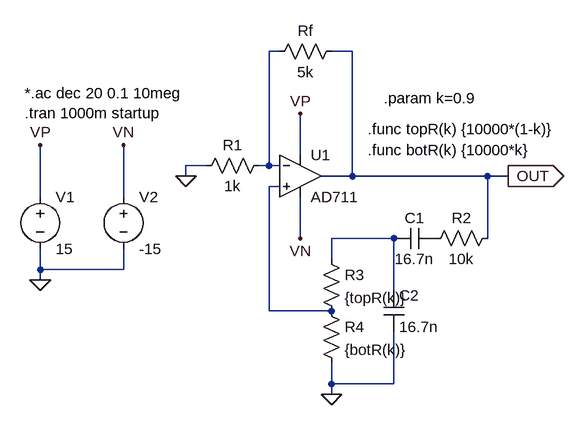
[diagram p0: schematic A2 21.asc]
A2 21.asc, the LTspice schematic file:
Version 4
SHEET 1 880 680
WIRE 128 -16 112 -16
WIRE 240 -16 208 -16
WIRE 160 144 160 80
WIRE 16 160 -16 160
WIRE 112 160 112 -16
WIRE 112 160 96 160
WIRE 128 160 112 160
WIRE -16 176 -16 160
WIRE 240 176 240 -16
WIRE 240 176 192 176
WIRE 448 176 240 176
WIRE 480 176 448 176
WIRE 128 192 112 192
WIRE -240 208 -240 128
WIRE -112 208 -112 128
WIRE 160 272 160 208
WIRE 304 272 208 272
WIRE 448 272 448 176
WIRE 208 304 208 272
WIRE -240 320 -240 288
WIRE -112 320 -112 288
WIRE -112 320 -240 320
WIRE -240 336 -240 320
WIRE 304 352 304 272
WIRE 112 384 112 192
WIRE 208 384 112 384
WIRE 208 496 208 464
WIRE 304 496 304 416
WIRE 304 496 208 496
WIRE 208 512 208 496
FLAG 160 80 VP
FLAG 160 272 VN
FLAG -240 336 0
FLAG -240 128 VP
FLAG -112 128 VN
FLAG 480 176 OUT
IOPIN 480 176 Out
FLAG -16 176 0
FLAG 208 512 0
SYMBOL OpAmps\\AD711 160 112 R0
SYMATTR InstName U1
SYMBOL voltage -240 192 R0
SYMATTR InstName V1
SYMATTR Value 15
SYMBOL voltage -112 192 R0
SYMATTR InstName V2
SYMATTR Value -15
SYMBOL res 224 -32 R90
WINDOW 0 0 56 VBottom 2
WINDOW 3 32 56 VTop 2
SYMATTR InstName Rf
SYMATTR Value 5k
SYMBOL res 112 144 R90
WINDOW 0 0 56 VBottom 2
WINDOW 3 32 56 VTop 2
SYMATTR InstName R1
SYMATTR Value 1k
SYMBOL res 464 256 R90
WINDOW 0 0 56 VBottom 2
WINDOW 3 32 56 VTop 2
SYMATTR InstName R2
SYMATTR Value 10k
SYMBOL cap 368 256 R90
WINDOW 0 0 32 VBottom 2
WINDOW 3 32 32 VTop 2
SYMATTR InstName C1
SYMATTR Value 16.7n
SYMBOL res 192 288 R0
SYMATTR InstName R3
SYMATTR Value {topR(k)}
SYMBOL res 192 368 R0
SYMATTR InstName R4
SYMATTR Value {botR(k)}
SYMBOL cap 288 352 R0
SYMATTR InstName C2
SYMATTR Value 16.7n
TEXT -264 48 Left 2 !*.ac dec 20 0.1 10meg \n.tran 1000m startup
TEXT 288 56 Left 2 !.param k=0.9
TEXT 264 104 Left 2 !.func topR(k) {10000*(1-k)}
TEXT 264 136 Left 2 !.func botR(k) {10000*k}

The netlist it stands for:
* A2 21.asc
XU1 N002 N001 VP VN OUT AD712  ; AD711, pins In+ In- V+ V- OUT
V1 VP 0 15
V2 VN 0 -15
Rf OUT N001 5k
R1 N001 0 1k
R2 OUT P001 10k
C1 P001 N003 16.7n
R3 N003 N002 {topR(k)}
R4 N002 0 {botR(k)}
C2 N003 0 16.7n
*.ac dec 20 0.1 10meg
.tran 1000m startup
.param k=0.9
.func topR(k) {10000*(1-k)}
.func botR(k) {10000*k}
.lib ADI1.lib
.backanno
.end